# EAGLE design test (EAGLE 7.6.0)
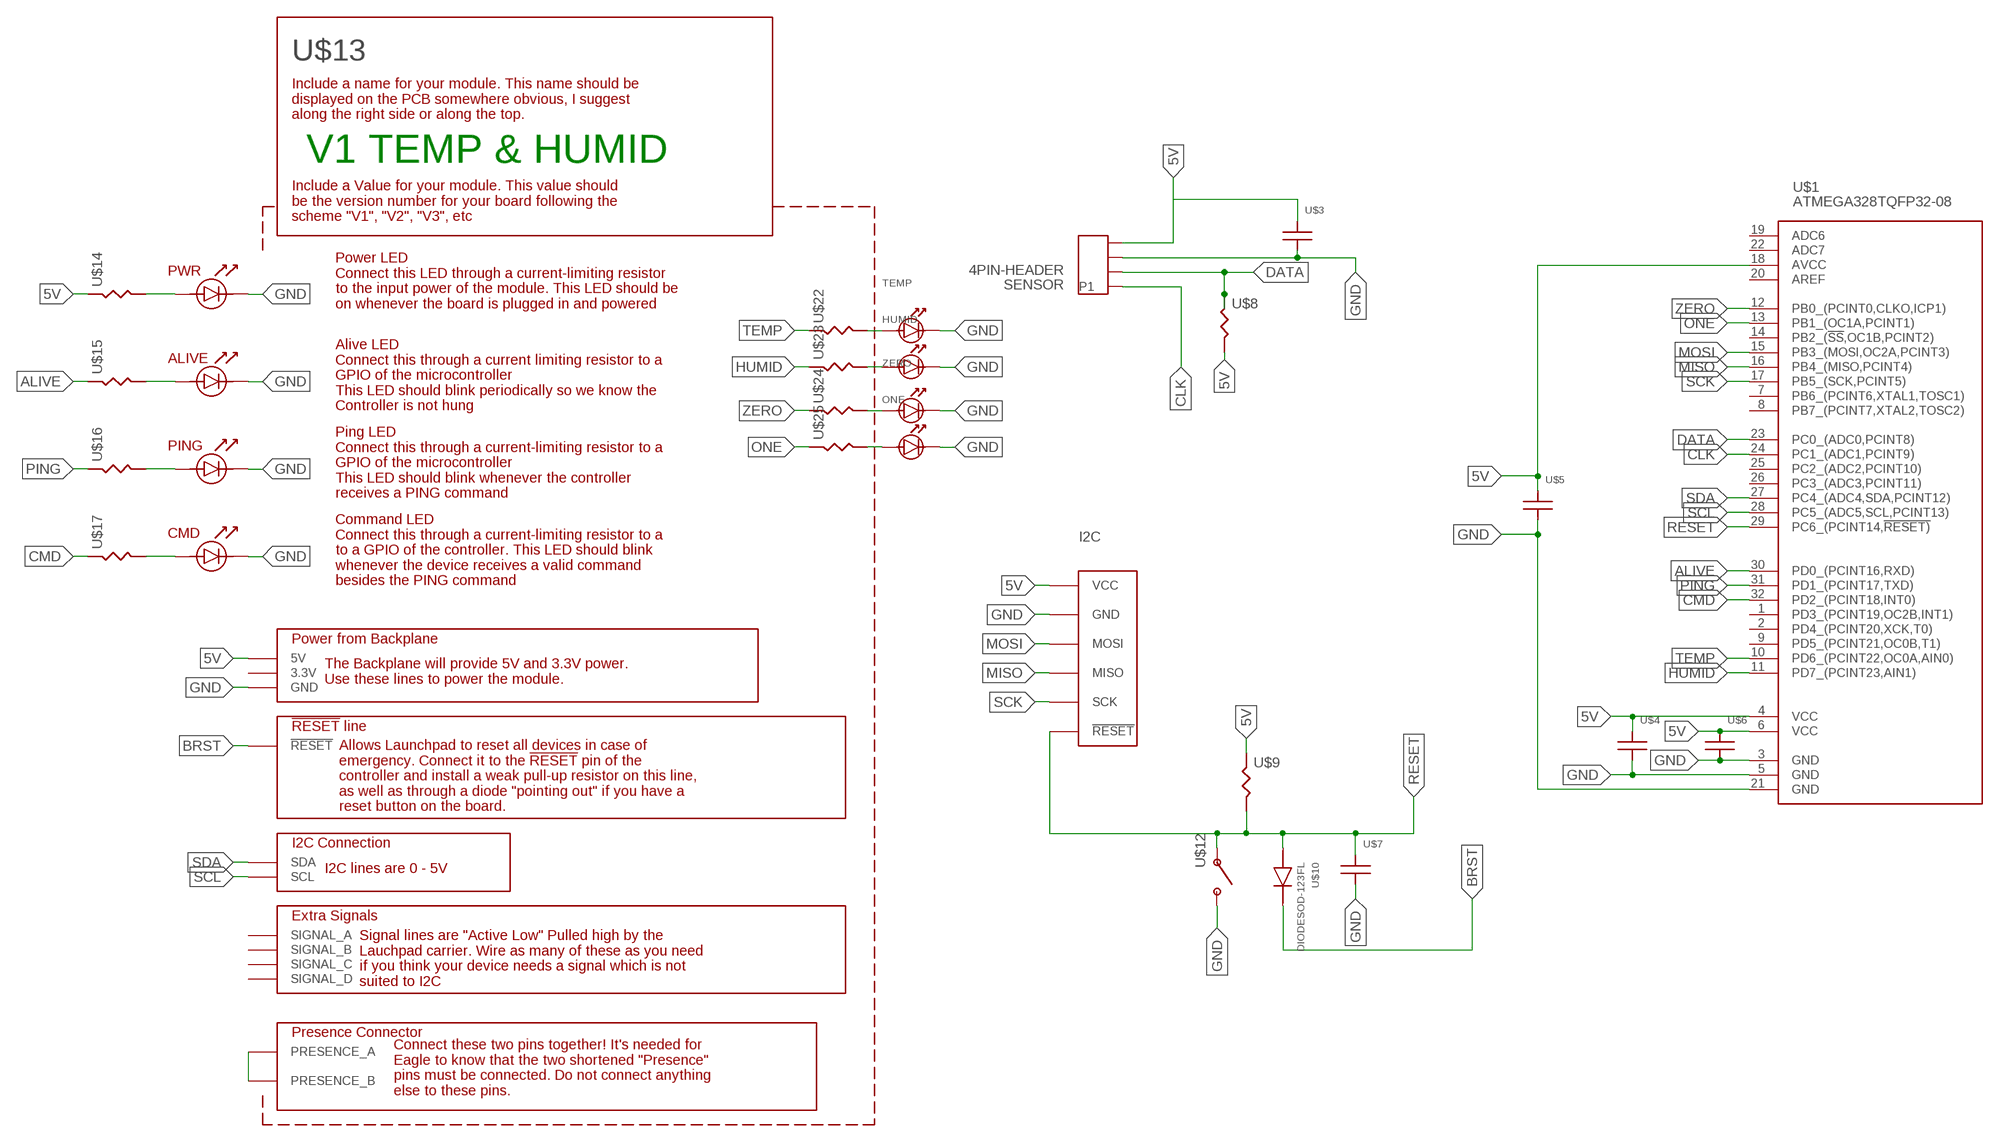
[diagram p0: schematic, sheet 1]

## Parts
HUMID  LED  [0805_LED]
I2C  ISP_PROGRAMMING_HEADER  [6PINHEADER_CORRECT]
ONE  LED  [0805_LED]
SENSOR  4PIN-HEADER  [4HEADER_10MIL]
TEMP  LED  [0805_LED]
U$1  ATMEGA328TQFP32-08  [TQFP32-08]
U$3  CAPACITOR-UNPOLARIZED0805  [0805_STACKPOLERESISTOR]
U$4  CAPACITOR-UNPOLARIZED0805  [0805_STACKPOLERESISTOR]
U$5  CAPACITOR-UNPOLARIZED0805  [0805_STACKPOLERESISTOR]
U$6  CAPACITOR-UNPOLARIZED0805  [0805_STACKPOLERESISTOR]
U$7  CAPACITOR-UNPOLARIZED0805  [0805_STACKPOLERESISTOR]
U$8  RESISTOR  [0805_STACKPOLERESISTOR]
U$9  RESISTOR  [0805_STACKPOLERESISTOR]
U$10  DIODESOD-123FL  [SOD-123FL]
U$12  PUSHBUTTONSMD  [PUSHBUTTON_SMD]
U$13  EMBEDDED_SUBSYSTEM_V2SMALL  [SUBSYSTEM2016_V2-SMALL]
U$14  RESISTOR  [0805_STACKPOLERESISTOR]
U$15  RESISTOR  [0805_STACKPOLERESISTOR]
U$16  RESISTOR  [0805_STACKPOLERESISTOR]
U$17  RESISTOR  [0805_STACKPOLERESISTOR]
U$22  RESISTOR  [0805_STACKPOLERESISTOR]
U$23  RESISTOR  [0805_STACKPOLERESISTOR]
U$24  RESISTOR  [0805_STACKPOLERESISTOR]
U$25  RESISTOR  [0805_STACKPOLERESISTOR]
ZERO  LED  [0805_LED]

## Nets
5V: I2C.2(VCC) SENSOR.P$4 U$1.4(VCC) U$1.6(VCC) U$1.18(AVCC) U$3.P$1 U$4.P$1 U$5.P$1 U$6.P$1 U$8.P$2 U$9.P$1 U$13.B2(5V) U$13.B3(5V) U$14.P$1
ALIVE: U$1.30(PD0_(PCINT16,RXD)) U$15.P$1
BRST: U$10.CATHODE U$13.B5(!RESET) U$13.B6(!RESET)
CLK: SENSOR.P$1(P1) U$1.24(PC1_(ADC1,PCINT9))
CMD: U$1.32(PD2_(PCINT18,INT0)) U$17.P$1
DATA: SENSOR.P$2 U$1.23(PC0_(ADC0,PCINT8)) U$8.P$1
GND: HUMID.CATHODE I2C.6(GND) ONE.CATHODE SENSOR.P$3 TEMP.CATHODE U$1.3(GND) U$1.5(GND) U$1.21(GND) U$3.P$2 U$4.P$2 U$5.P$2 U$6.P$2 U$7.P$2 U$12.3 U$13.A7(GND) U$13.A8(GND) U$13.A9(GND) U$13.A10(GND) U$13.ALIVELED_CATHODE U$13.CMDLED_CATHODE U$13.PINGLED_CATHODE U$13.PWRLED_CATHODE ZERO.CATHODE
HUMID: U$1.11(PD7_(PCINT23,AIN1)) U$23.P$1
MISO: I2C.1(MISO) U$1.16(PB4_(MISO,PCINT4))
MOSI: I2C.4(MOSI) U$1.15(PB3_(MOSI,OC2A,PCINT3))
N$1: U$13.A2(PRESENCE_A) U$13.B17(PRESENCE_B)
N$2: U$13.PWRLED_ANODE U$14.P$2
N$3: U$13.ALIVELED_ANODE U$15.P$2
N$4: U$13.PINGLED_ANODE U$16.P$2
N$5: U$13.CMDLED_ANODE U$17.P$2
N$6: TEMP.ANODE U$22.P$2
N$7: HUMID.ANODE U$23.P$2
N$8: U$24.P$2 ZERO.ANODE
N$9: ONE.ANODE U$25.P$2
ONE: U$1.13(PB1_(OC1A,PCINT1)) U$25.P$1
PING: U$1.31(PD1_(PCINT17,TXD)) U$16.P$1
RESET: I2C.5(!RESET) U$1.29(PC6_(PCINT14,!RESET)) U$7.P$1 U$9.P$2 U$10.ANODE U$12.1
SCK: I2C.3(SCK) U$1.17(PB5_(SCK,PCINT5))
SCL: U$1.28(PC5_(ADC5,SCL,PCINT13)) U$13.B9(SCL) U$13.B10(SCL)
SDA: U$1.27(PC4_(ADC4,SDA,PCINT12)) U$13.B7(SDA) U$13.B8(SDA)
TEMP: U$1.10(PD6_(PCINT22,OC0A,AIN0)) U$22.P$1
ZERO: U$1.12(PB0_(PCINT0,CLKO,ICP1)) U$24.P$1
Unconnected: U$1.1(PD3_(PCINT19,OC2B,INT1)) U$1.2(PD4_(PCINT20,XCK,T0)) U$1.7(PB6_(PCINT6,XTAL1,TOSC1)) U$1.8(PB7_(PCINT7,XTAL2,TOSC2)) U$1.9(PD5_(PCINT21,OC0B,T1)) U$1.14(PB2_(!SS,OC1B,PCINT2)) U$1.19(ADC6) U$1.20(AREF) U$1.22(ADC7) U$1.25(PC2_(ADC2,PCINT10)) U$1.26(PC3_(ADC3,PCINT11)) U$13.A3(3.3V) U$13.A4(3.3V) U$13.A13(SIGNAL_C) U$13.A14(SIGNAL_C) U$13.A15(SIGNAL_D) U$13.A16(SIGNAL_D) U$13.B13(SIGNAL_A) U$13.B14(SIGNAL_A) U$13.B15(SIGNAL_B) U$13.B16(SIGNAL_B)

## Notes on the sheet
- V1 TEMP & HUMID

## Library data of the parts
HUMID ONE TEMP ZERO = 000_CustomPartsMaster:LED
I2C = 000_CustomPartsMaster:ISP_PROGRAMMING_HEADER
SENSOR = 000_CustomPartsMaster:4PIN-HEADER
U$1 = 000_CustomPartsMaster:ATMEGA328
U$3-U$7 = 000_CustomPartsMaster:CAPACITOR-UNPOLARIZED
U$8 U$9 U$14-U$17 U$22-U$25 = 000_CustomPartsMaster:RESISTOR
U$10 = 000_CustomPartsMaster:DIODE
U$12 = 000_CustomPartsMaster:PUSHBUTTON
U$13 = 000_CustomPartsMaster:EMBEDDED_SUBSYSTEM_V2

## Board
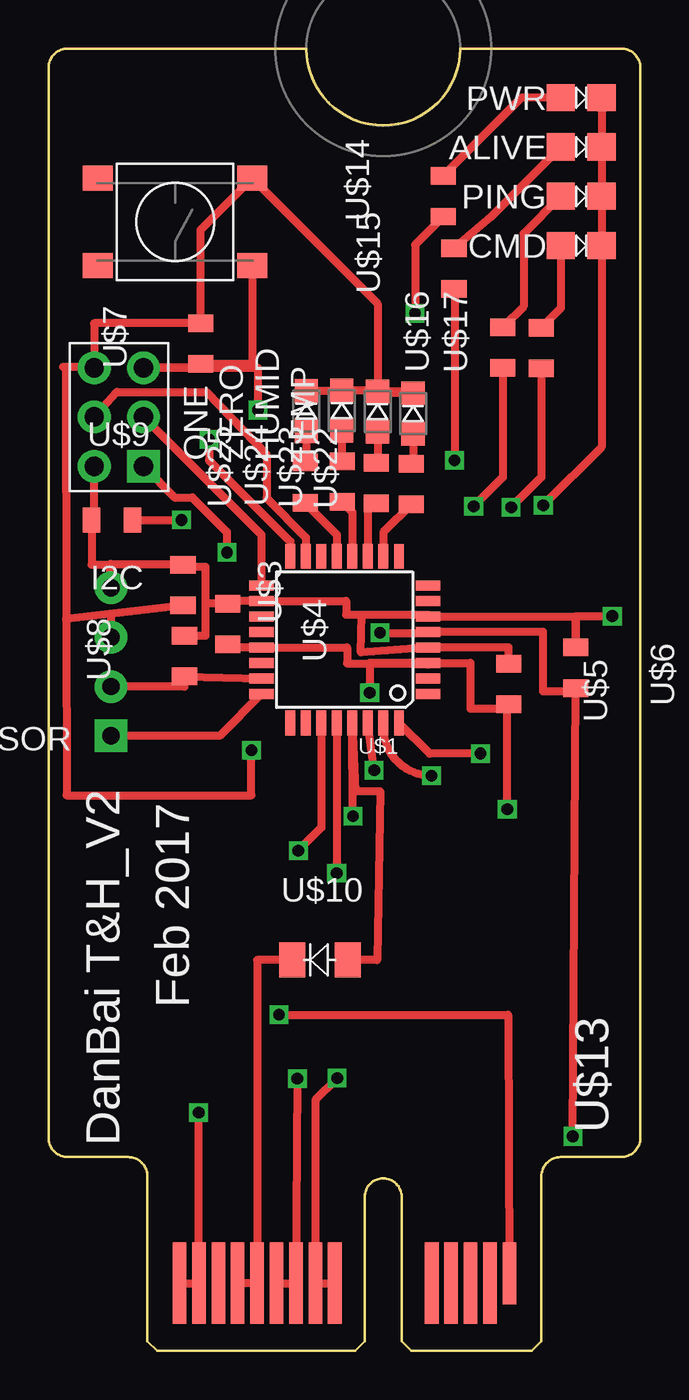
[diagram p1: board, top side]
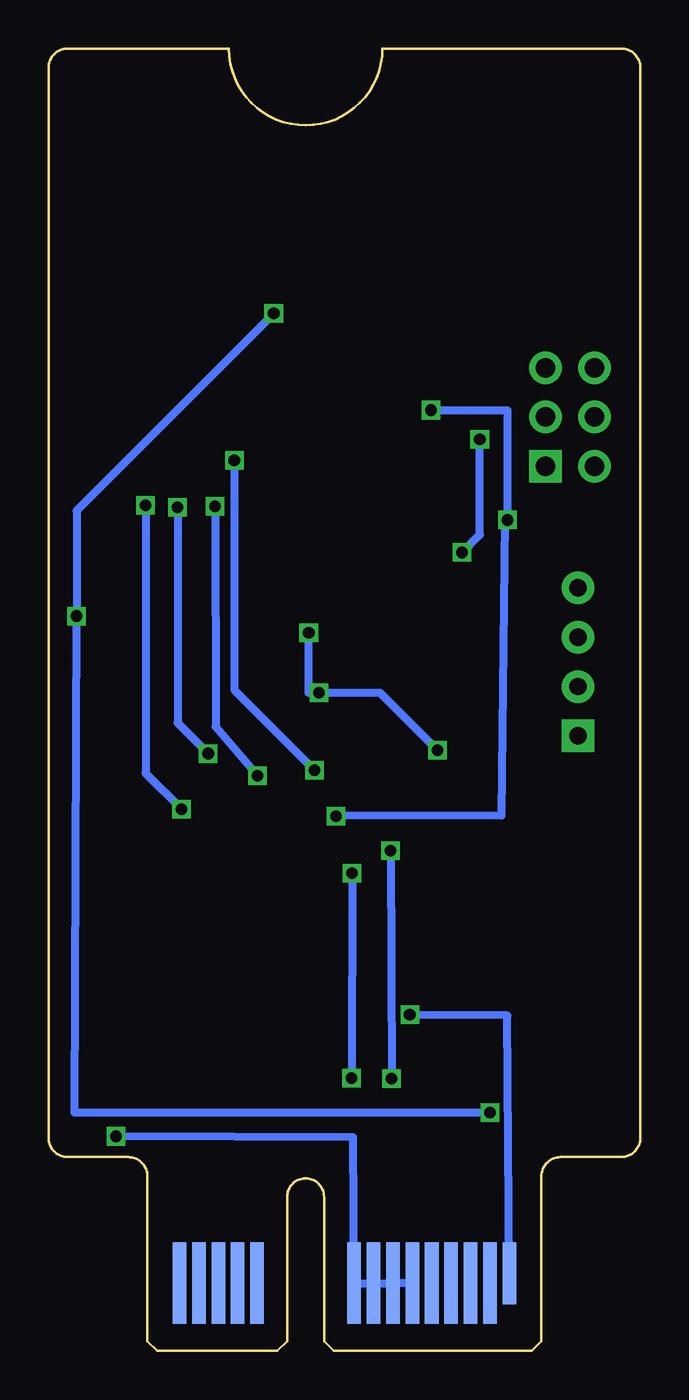
[diagram p2: board, bottom side, seen from below]

Size 30.5 x 67.15 mm. Coordinates in mm from the lower left corner, seen from the top.
Copper layers (1*16): Top 0.0356mm / dielectric 1.5011mm / Bottom 0.0356mm
Design rules "LaenPCBOrder": minimum track width 6mil, minimum drill 13mil, track to track 6mil, track to pad 6mil, pad to pad 6mil, via to via 6mil, smd to smd 6mil, copper to edge 15mil, drill to drill 6mil, minimum pad ring 7mil, minimum via ring 7mil, stop-mask expansion 3mil, vias tented up to drill 0mil, thermal gap 10mil

### Footprints (pad centres in the part's own frame; a part is rotated, then mirrored left to right if it is on the bottom)
0805_LED = smd 1.2 x 1.2: ANODE -1.05,0; CATHODE 1.05,0
6PINHEADER_CORRECT = drill 1 pad 1.676 square: 1 0,0 | drill 1 pad 1.676: 2 2.54,0; 3 0,-2.54; 4 2.54,-2.54; 5 0,-5.08; 6 2.54,-5.08
4HEADER_10MIL = drill 0.9 pad 1.676 square: P$1 0,3.81 | drill 0.9 pad 1.676: P$2 0,1.27; P$3 0,-1.27; P$4 0,-3.81
TQFP32-08 = smd 1.27 x 0.508: 1 -4.293,2.8; 2 -4.293,2; 3 -4.293,1.2; 4 -4.293,0.4; 5 -4.293,-0.4; 6 -4.293,-1.2; 7 -4.293,-2; 8 -4.293,-2.8; 17 4.293,-2.8; 18 4.293,-2; 19 4.293,-1.2; 20 4.293,-0.4; 21 4.293,0.4; 22 4.293,1.2; 23 4.293,2; 24 4.293,2.8 | smd 0.508 x 1.27: 9 -2.8,-4.293; 10 -2,-4.293; 11 -1.2,-4.293; 12 -0.4,-4.293; 13 0.4,-4.293; 14 1.2,-4.293; 15 2,-4.293; 16 2.8,-4.293; 25 2.8,4.293; 26 2,4.293; 27 1.2,4.293; 28 0.4,4.293; 29 -0.4,4.293; 30 -1.2,4.293; 31 -2,4.293; 32 -2.8,4.293
0805_STACKPOLERESISTOR = smd 0.9 x 1.3: P$1 -1.05,0; P$2 1.05,0
SOD-123FL = smd 1.34 x 1.8: ANODE 1.43,0; CATHODE -1.43,0
PUSHBUTTON_SMD = smd 1.55 x 1.3: 1 -3.975,2.25; 2 3.975,2.25; 3 -3.975,-2.25; 4 3.975,-2.25
SUBSYSTEM2016_V2-SMALL = smd 0.7 x 3.2 bottom: A2 6.73,4.16 | smd 0.7 x 4.2 bottom: A3 7.73,3.66; A4 8.73,3.66; A5 9.73,3.66; A6 10.73,3.66; A7 11.73,3.66; A8 12.73,3.66; A9 13.73,3.66; A10 14.73,3.66; A13 19.73,3.66; A14 20.73,3.66; A15 21.73,3.66; A16 22.73,3.66; A17 23.73,3.66 | smd 1.45 x 1.4: ALIVELED_ANODE 26.382,62.23; ALIVELED_CATHODE 28.482,62.23; CMDLED_ANODE 26.382,57.15; CMDLED_CATHODE 28.482,57.15; PINGLED_ANODE 26.382,59.69; PINGLED_CATHODE 28.482,59.69; PWRLED_ANODE 26.382,64.77; PWRLED_CATHODE 28.482,64.77 | smd 0.7 x 4.2: B2 6.73,3.66; B3 7.73,3.66; B4 8.73,3.66; B5 9.73,3.66; B6 10.73,3.66; B7 11.73,3.66; B8 12.73,3.66; B9 13.73,3.66; B10 14.73,3.66; B13 19.73,3.66; B14 20.73,3.66; B15 21.73,3.66; B16 22.73,3.66 | smd 0.7 x 3.2: B17 23.73,4.16

### Placement (x,y rotation side)
HUMID  16.96,48.43 90 top
I2C  4.9,45.61 180 top
ONE  13.28,48.46 90 top
SENSOR  3.22,35.53 180 top
TEMP  18.79,48.33 90 top
U$1  15.26,36.67 180 top
U$3  6.93,39.49 270 top
U$4  9.24,37.48 270 top
U$5  23.72,34.38 270 top
U$6  27.17,35.22 270 top
U$7  7.84,51.94 90 top
U$8  7,35.83 90 top
U$9  3.27,42.84 0 top
U$10  13.99,20.16 0 top
U$12  6.52,58.21 180 top
U$13  0.02,-0.16 0 top
U$14  20.34,59.53 90 top
U$15  20.9,55.8 90 top
U$16  23.41,51.73 90 top
U$17  25.39,51.71 90 top
U$22  18.69,44.7 90 top
U$23  16.89,44.75 90 top
U$24  15.13,44.82 90 top
U$25  13.23,44.77 90 top
ZERO  15.11,48.48 90 top

### Tracks (layer width: path | path; a pad name or v marks a point on that pad's centre or on a via)
5V  (via drill 0.6)
  Top 0.406: U$13.B2 U$13.B3 v7.74,12.29 | v29.05,37.89 27.17,37.89 U$6.P$1 27.17,37.87 U$1.6 19.55,37.97 16.15,37.97 | U$5.P$1 23.72,36.27 U$1.4 16.1,36.02 16.15,37.97 | 8.1,38.53 U$4.P$1 9.24,38.67 U$1.18 15.34,38.67 15.34,37.97 16.15,37.97 | 8.1,38.53 8.1,40.43 6.93,40.43 U$3.P$1 3.17,40.54 | 3.17,40.54 SENSOR.P$4 3.19,40.58 | I2C.2 2.36,42.84 U$9.P$1 2.22,40.54 3.17,40.54 | U$14.P$1 18.89,57.03 v18.89,53.49 | U$8.P$2 8.1,36.88 8.1,38.53
  Bottom 0.406: v7.74,12.29 29.15,12.29 v29.05,37.89 29.05,43.33 v18.89,53.49
ALIVE  (via drill 0.6)
  Top 0.406: U$15.P$1 20.92,54.67 v20.92,45.92 | v16.78,29.94 U$1.30
  Bottom 0.406: v20.92,45.92 20.92,34.08 v16.78,29.94
BRST
  Top 0.406: U$10.CATHODE 10.75,20.16 U$13.B6 U$13.B5
CLK
  Top 0.406: U$1.24 8.81,31.72 SENSOR.P$1
CMD  (via drill 0.6)
  Top 0.406: U$17.P$1 25.39,45.05 v23.84,43.5 | v22.27,30.8 19.63,30.8 U$1.32
  Bottom 0.406: v23.84,43.5 23.84,32.38 v22.27,30.8
DATA
  Top 0.406: U$1.23 U$8.P$1 7,34.26 SENSOR.P$2
GND  (via drill 0.6)
  Top 0.406: v27.02,11.07 U$6.P$2 27.17,34 25.5,34 25.5,37.07 20.09,37.07 | 19.55,35.38 U$1.3 | 20.09,37.07 U$1.5 | U$1.3 21.74,35.47 21.74,33.11 23.72,33.11 U$5.P$2 23.64,33.26 v23.64,27.93 | U$4.P$2 9.24,36.27 U$1.21 15.39,36.27 15.39,35.45 19.55,35.45 U$1.3 | SENSOR.P$3 3.22,37.98 U$3.P$2 0.91,37.73 | 0.88,50.74 2.36,50.74 | U$13.PWRLED_CATHODE U$13.ALIVELED_CATHODE U$13.PINGLED_CATHODE U$13.CMDLED_CATHODE 28.5,46.61 v25.5,43.6 | HUMID.CATHODE 16.96,54 U$12.3 7.84,57.81 U$7.P$2 2.36,52.99 2.36,50.74 | 2.36,50.74 I2C.6 | U$1.3 16.55,35.47 v16.55,33.93 | v17.09,37.03 20.09,37.03 20.09,37.07 | 0.91,37.73 0.93,28.64 10.46,28.64 v10.46,30.98 | ONE.CATHODE 15.11,49.51 ZERO.CATHODE 16.96,49.53 HUMID.CATHODE | HUMID.CATHODE 19.02,49.48 19.02,48.91 | TEMP.CATHODE 16.96,49.38 HUMID.CATHODE | 0.76,50.74 0.88,50.74 | 0.88,50.74 0.91,37.73
  Bottom 0.406: U$13.A7 U$13.A8 U$13.A9 U$13.A10 14.8,11.02 v27.02,11.07 | v25.5,43.6 25.5,29.79 v23.64,27.93 | v17.09,37.03 17.09,33.93 v16.55,33.93 13.41,33.93 v10.46,30.98
HUMID
  Top 0.406: U$23.P$1 16.46,43.27 U$1.11
MISO  (via drill 0.6)
  Top 0.406: I2C.1 6.5,44.01 7.41,44.01 9.19,42.23 v9.19,41.17 | v8.28,47.01 8.28,45.92 12.46,41.73 U$1.16
  Bottom 0.406: v9.19,41.17 8.28,42.08 v8.28,47.01
MOSI
  Top 0.406: I2C.4 3.52,49.45 8.15,49.45 11.25,46.22 11.25,43.96 13.26,41.95 U$1.15
N$1  (via drill 0.6)
  Top 0.406: v11.88,17.34 23.69,17.34 U$13.B17
  Bottom 0.406: U$13.A2 6.85,17.29 v11.88,17.34
N$2
  Top 0.406: U$13.PWRLED_ANODE 24.37,64.61 U$14.P$2
N$3
  Top 0.406: U$13.ALIVELED_ANODE 22.78,58.45 U$15.P$2
N$4
  Top 0.406: U$13.PINGLED_ANODE 24.48,57.61 24.48,53.85 U$16.P$2
N$5
  Top 0.406: U$13.CMDLED_ANODE 26.4,53.76 U$17.P$2
N$6
  Top 0.406: TEMP.ANODE 18.79,45.85 U$22.P$2
N$7
  Top 0.406: HUMID.ANODE 16.96,45.87 U$23.P$2
N$8
  Top 0.406: ZERO.ANODE 15.11,45.9 U$24.P$2
N$9
  Top 0.406: ONE.ANODE 13.28,45.87 U$25.P$2
ONE
  Top 0.406: U$25.P$1 14.86,42.09 U$1.13
PING  (via drill 0.6)
  Top 0.406: U$16.P$1 23.41,45.05 v21.91,43.55 | v19.73,29.66 arc-90 17.26,32.13 U$1.31
  Bottom 0.406: v21.91,43.55 21.89,32.17 v19.73,29.66
RESET  (via drill 0.6)
  Top 0.406: U$9.P$2 v6.85,42.84 | v15.69,27.58 U$1.29 15.81,28.87 17.09,28.87 16.94,20.16 U$10.ANODE | U$12.1 10.5,50.89 U$7.P$1 7.84,50.69 I2C.5 10.79,50.69 v10.79,48.51
  Bottom 0.406: v15.69,27.58 7.16,27.6 6.98,42.84 v6.85,42.84 6.85,48.51 v10.79,48.51
SCK
  Top 0.406: I2C.3 10.97,42.08 U$1.17
SCL  (via drill 0.6)
  Top 0.406: U$13.B10 U$13.B9 13.75,12.94 v14.88,14.06 | U$1.28 v14.85,24.63
  Bottom 0.406: v14.85,24.63 v14.88,14.06
SDA  (via drill 0.6)
  Top 0.406: U$13.B7 U$13.B8 v12.82,14.04 | U$1.27 14.06,26.99 v12.87,25.8
  Bottom 0.406: v12.87,25.8 v12.82,14.04
TEMP
  Top 0.406: U$22.P$1 17.26,42.22 U$1.10
ZERO
  Top 0.406: U$24.P$1 15.66,43.25 U$1.12

### Text on the board
tPlace: Feb 2017 | DanBai T&H_V2